# Altium project EMP_Drone_Flight_Controller.PrjPcb (part 1 of 2)
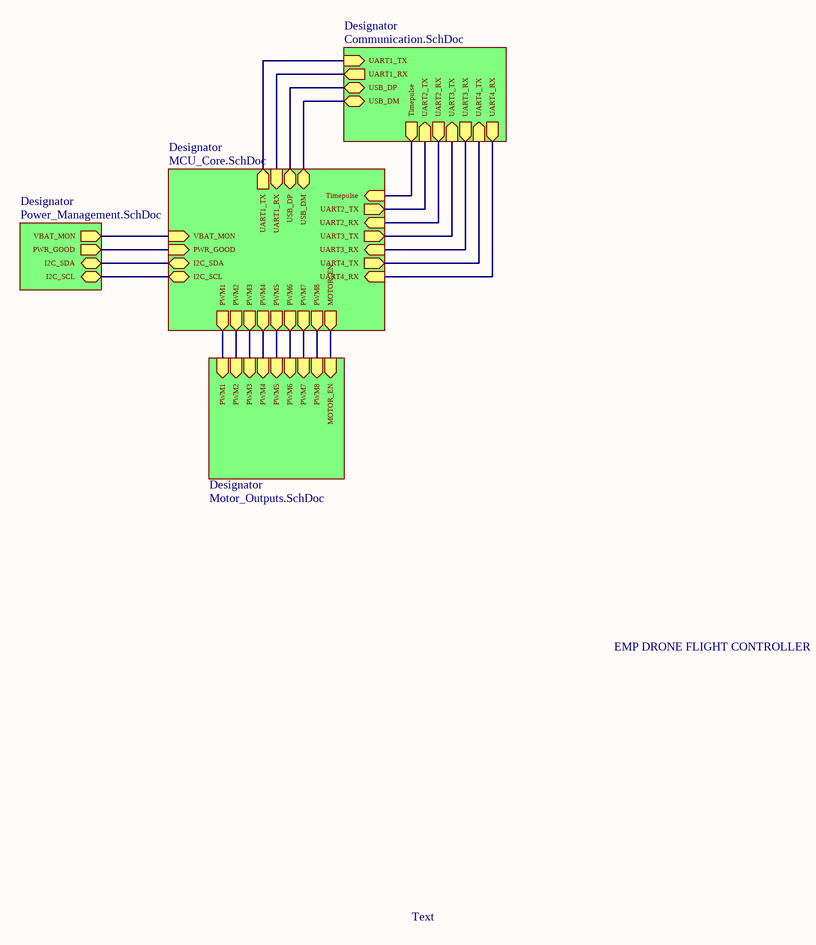
[diagram p0: EMP_FC_Main.SchDoc]
5 sheets, 137 parts. Net scope: hierarchical (ports join the sheet entries above them; power ports are global).
Board file: EMP_FC_PCB.PcbDoc
Sheets:
  EMP_FC_Main.SchDoc
    Designator = Power_Management.SchDoc
    Designator = MCU_Core.SchDoc
    Designator = Communication.SchDoc
    Designator = Motor_Outputs.SchDoc

## Sheet EMP_FC_Main.SchDoc
size A4; SheetNumber: 1; SheetTotal: 5

### Sub-sheets
Designator = Power_Management.SchDoc: VBAT_MON (out), PWR_GOOD (out), I2C_SDA (bidir), I2C_SCL (bidir)
Designator = MCU_Core.SchDoc: UART1_TX (out), UART1_RX (in), USB_DM (bidir), USB_DP (bidir), PWM5 (out), PWM4 (out), PWM3 (out), PWM2 (out), PWM1 (out), PWM6 (out), PWM7 (out), PWM8 (out), VBAT_MON (in), PWR_GOOD (in), MOTOR_EN (out), UART2_TX (out), UART3_TX (out), UART4_TX (out), UART2_RX (in), UART3_RX (in), UART4_RX (in), Timepulse (in), I2C_SDA (bidir), I2C_SCL (bidir)
Designator = Communication.SchDoc: UART1_TX (in), UART1_RX (out), USB_DP (bidir), USB_DM (bidir), UART2_RX (out), UART3_RX (out), UART4_RX (out), UART2_TX (in), UART3_TX (in), UART4_TX (in), Timepulse (out)
Designator = Motor_Outputs.SchDoc: PWM1 (in), PWM2 (in), PWM3 (in), PWM4 (in), PWM5 (in), MOTOR_EN (in), PWM6 (in), PWM7 (in), PWM8 (in)

### Nets
D_N: sheet Designator/USB_DM, sheet Designator/USB_DM
D_P: sheet Designator/USB_DP, sheet Designator/USB_DP
LMSCL: sheet Designator/I2C_SCL, sheet Designator/I2C_SCL
LMSDA: sheet Designator/I2C_SDA, sheet Designator/I2C_SDA
NetJ5_3: sheet Designator/MOTOR_EN, sheet Designator/MOTOR_EN
NetMD1_3: sheet Designator/Timepulse, sheet Designator/Timepulse
NetMD1_20: sheet Designator/UART4_RX, sheet Designator/UART4_RX
NetMD1_21: sheet Designator/UART4_TX, sheet Designator/UART4_TX
NetP1_2: sheet Designator/UART2_TX, sheet Designator/UART2_TX
NetP1_3: sheet Designator/UART2_RX, sheet Designator/UART2_RX
NetP2_2: sheet Designator/UART1_TX, sheet Designator/UART1_TX
NetP2_3: sheet Designator/UART1_RX, sheet Designator/UART1_RX
NetR9_1: sheet Designator/PWM1, sheet Designator/PWM1
NetR10_1: sheet Designator/PWM2, sheet Designator/PWM2
NetR11_1: sheet Designator/PWM3, sheet Designator/PWM3
NetR12_1: sheet Designator/PWM4, sheet Designator/PWM4
NetR13_1: sheet Designator/PWM5, sheet Designator/PWM5
NetR14_1: sheet Designator/PWM6, sheet Designator/PWM6
NetR15_1: sheet Designator/PWM7, sheet Designator/PWM7
NetR16_1: sheet Designator/PWM8, sheet Designator/PWM8
NetR42_1: sheet Designator/VBAT_MON, sheet Designator/VBAT_MON
NetU1_14: sheet Designator/UART3_TX, sheet Designator/UART3_TX
NetU1_15: sheet Designator/UART3_RX, sheet Designator/UART3_RX
NetU2_98: sheet Designator/PWR_GOOD, sheet Designator/PWR_GOOD

### Notes on the sheet
- EMP DRONE FLIGHT CONTROLLER
- Text

## Sheet Power_Management.SchDoc
size A3; SheetNumber: 2; SheetTotal: 5
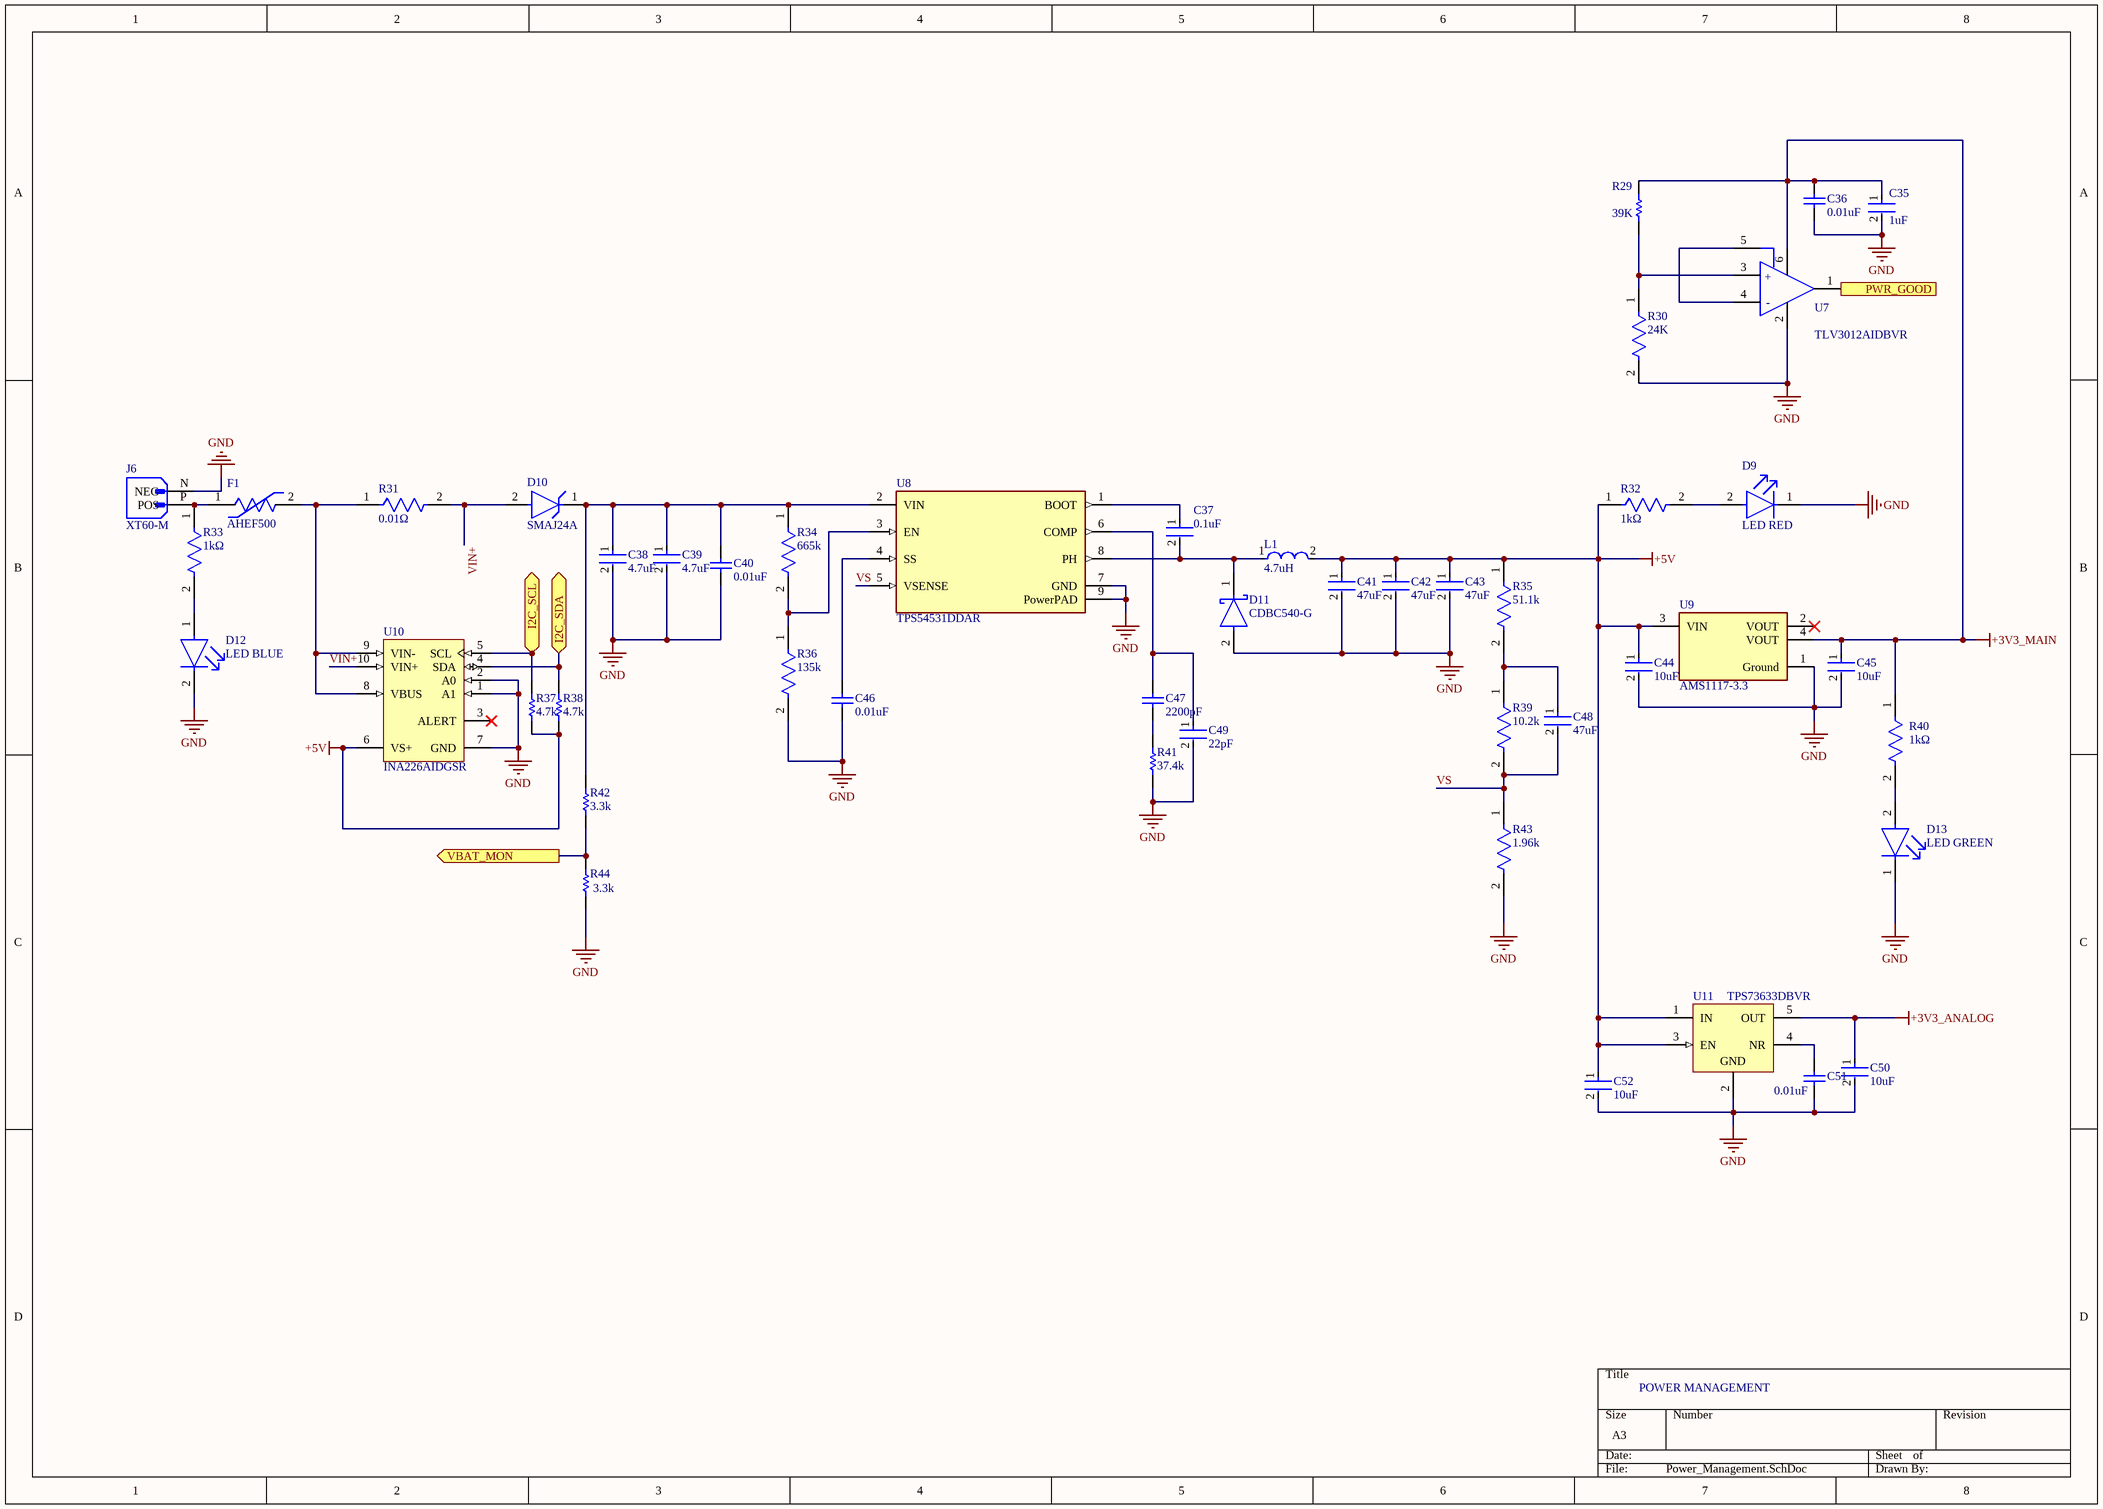
[diagram p1: Power_Management.SchDoc]

### Parts
C35  1uF  [FP-GCJ21B-0_3-IPC_B]
C36  0.01uF  [CAPC1608X87X35NL15T15]
C37  0.1uF  [FP-0805B-IPC_C]
C38  4.7uF  [FP-CC0603-DA-MFG]
C39  4.7uF  [FP-CC0603-DA-MFG]
C40  0.01uF  [CAPC1608X87X35NL15T15]
C41  47uF  [FP-0603-L_1_6_0_2-W_0_8_0-MFG]
C42  47uF  [FP-0603-L_1_6_0_2-W_0_8_0-MFG]
C43  47uF  [FP-0603-L_1_6_0_2-W_0_8_0-MFG]
C44  10uF  [FP-C0603C106M8PACTU-MFG]
C45  10uF  [FP-C0603C106M8PACTU-MFG]
C46  0.01uF  [CAPC1608X87X35NL15T15]
C47  2200pF  [CAPC1608X90X35NL15T15]
C48  47uF  [FP-0603-L_1_6_0_2-W_0_8_0-MFG]
C49  22pF  [FP-C0603C-CF-MFG]
C50  10uF  [FP-C0805C106K8RACAUTO-MFG]
C51  0.01uF  [CAPC1608X87X35NL15T15]
C52  10uF  [FP-C0805C106K8RACAUTO-MFG]
D9  LED RED  [FP-SML-LXT0805IW-TR-MFG]
D10  SMAJ24A  [FP-SMAJ-MFG]
D11  CDBC540-G  [FP-DO-214AB_SMC-MFG]
D12  LED BLUE  [FP-SM0805UBWC-MFG]
D13  LED GREEN  [FP-LTST-C171GKT-MFG]
F1  AHEF500  [FP-AHEF500-MFG]
J6  XT60-M  [AMASS_XT60-M]
L1  4.7uH  [FP-MLZ1608-IPC_A]
R29  39K  [RESC0603(1608)_L]
R30  24K  [FP-CRCW0603-Pe3-MFG]
R31  0.01Ω  [FP-GMR320-MFG]
R32  1kΩ  [FP-RNCF0603-MFG]
R33  1kΩ  [FP-RNCF0603-MFG]
R34  665k  [FP-CRCW0603-HPe3-IPC_B]
R35  51.1k  [FP-CRCW0603-e3-IPC_B]
R36  135k  [FP-CRCW0603-e3-IPC_C]
R37  4.7k  [RESC3225X75X50ML15T25]
R38  4.7k  [RESC3225X75X50ML15T25]
R39  10.2k  [FP-AC0603-IPC_B]
R40  1kΩ  [FP-RNCF0603-MFG]
R41  37.4k  [RESC1608X55X25NL10T15]
R42  3.3k  [RESC1812(4532)_L]
R43  1.96k  [FP-CRCW0603-HPe3-IPC_B]
R44  3.3k  [RESC2512(6432)_M]
U7  TLV3012AIDBVR  [FP-DBV0006A-IPC_B]
U8  TPS54531DDAR  [FP-DDA0008E-MFG]
U9  AMS1117-3.3  [FP-AMS1117-IPC_C]
U10  INA226AIDGSR  [DGS0010A_L]
U11  TPS73633DBVR  [DBV0005A_L]

### Ports
I2C_SCL (bidir, see EMP_FC_Main[2C], MCU_Core[7A]), I2C_SDA (bidir, see EMP_FC_Main[2C], MCU_Core[7A]), PWR_GOOD (out, see EMP_FC_Main[2C], MCU_Core[3B]), VBAT_MON (out, see EMP_FC_Main[2B], MCU_Core[3B])

### Nets
+3V3_ANALOG: C50.1 U11.5(OUT)
+3V3_MAIN: C35.1 C36.2 C45.1 R29.2 R40.1 U7.6(V+) U9.4(VOUT)
+5V: C41.1 C42.1 C43.1 C44.1 C52.1 L1.2 R32.1 R35.1 R37.1 R38.1 U9.3(VIN) U10.6(VS+) U11.1(IN) U11.3(EN)
GND: C35.2 C36.1 C38.2 C39.2 C40.1 C41.2 C42.2 C43.2 C44.2 C45.2 C46.1 C49.2 C50.2 C51.1 C52.2 D9.1(C) D11.2(A) D12.2(C) D13.1(C) J6.N(NEG) R30.2 R36.2 R41.1 R43.2 R44.1 U7.2(V-) U8.7(GND) U8.9(PowerPAD) U9.1(Ground) U10.1(A1) U10.2(A0) U10.7(GND) U11.2(GND)
LMSCL: R37.2 U10.5(SCL) ; port I2C_SCL
LMSDA: R38.2 U10.4(SDA) ; port I2C_SDA
VIN+: D10.2(A) R31.2 U10.10(VIN+)
VS: C48.2 R39.2 R43.1 U8.5(VSENSE)
NetC37_1: C37.1 U8.1(BOOT)
NetC37_2: C37.2 D11.1(C) L1.1 U8.8(PH)
NetC38_1: C38.1 C39.1 C40.2 D10.1(C) R34.1 R42.2 U8.2(VIN)
NetC46_2: C46.2 U8.4(SS)
NetC47_1: C47.1 R41.2
NetC47_2: C47.2 C49.1 U8.6(COMP)
NetC48_1: C48.1 R35.2 R39.1
NetC51_2: C51.2 U11.4(NR)
NetD9_2: D9.2(A) R32.2
NetD12_1: D12.1(A) R33.2
NetD13_2: D13.2(A) R40.2
NetF1_1: F1.1 J6.P(POS) R33.1
NetF1_2: F1.2 R31.1 U10.8(VBUS) U10.9(VIN-)
NetR29_1: R29.1 R30.1 U7.3(IN+)
NetR34_2: R34.2 R36.1 U8.3(EN)
NetR42_1: R42.1 R44.2 ; port VBAT_MON
NetU2_98: U7.1(OUT) ; port PWR_GOOD
NetU7_4: U7.4(IN-) U7.5(REF)

Not connected (* = marked no-connect by the designer): U9 2(VOUT)*; U10 3(ALERT)*

### Notes on the sheet
- POWER MANAGEMENT
- (in symbol CMP-04896-000075-1) +

### Library data of the parts
C35 = CMP-06035-032003-1: Multilayer Ceramic Capacitors MLCC - SMD/SMT 0805 1uF 10%, 16VDC,  X8L +15/-40%
C36 C40 C46 C51 = CMP-2006-03841-1: Part Number: C0603S103J5RACTU; Manufacturer: Kemet
C37 = CMP-45632-000003-1: CAP CER 0.1UF 50V X7R 0805; Capacitance: 100nF; Tolerance: 10%; RoHS Compliant: Yes; Packaging: Tape and Reel; Voltage Rating (DC): 50V; Voltage Rating: 50V; Length: 2mm; Lead Free: Lead Free; Voltage: 50V; Case/Package: 0805; Case Code (Metric): 2012; Depth: 1.25mm; Min Operating Temperature: -55°C; Case Code (Imperial): 0805; Max Operating Temperature: 125°C; Radiation Hardening: No; Dielectric: X7R
C38 C39 = CMP-03422-001217-1: CAP CER 4.7UF 25V X5R 0603; Manufacturer: YAGEO; Manufacturer Part Number: CC0603KRX5R8BB475; Material: Ceramic; Temperature Coefficient: 15%; Tolerance: 0.1; Device Class L1: Passive Components; Temperature: -55°C to +125°C; Value: 4.7 uF; RoHS: TRUE; Temperature Range High: +125°C; Automotive: No; Lead Free: Yes; Digikey Description: CAP CER 4.7UF 25V X5R 0603; Category: Cap; Temperature Characteristic: X5R; Package: CC0603-DA; Device Class L2: Capacitors; Temperature Range Low: -55°C; Voltage Rating: 25 V; Capacitance: 4.7 uF; ComponentLink2URL: http://www.yageo.com/documents/recent/UPY-GPHC_X7R_6.3V-to-50V_18.pdf; Octopart: https://octopart.com/cc0603krx5r8bb475-yageo-77825350; Footprint Url: http://www.yageo.com/exep/pages/download/literatures/UPY-C_GEN_24.pdf; Device Class L3: Ceramic Capacitors; ComponentLink2Description: Datasheet; Voltage: 25 V; Height: 0.9mm
C41-C43 C48 = CMP-14477-005318-1: Multilayer Ceramic Capacitor 47uF 4V X6S 20% SMD 0603 T/R
C44 C45 = CMP-03020-034654-1: CAP CER 10UF 10V X5R 0603; RoHS Compliant: Yes
C47 = CMP-2006-04411-1: Manufacturer: AVX Interconnect / Elco; Part Number: 06035C222KAZ2A
C49 = CMP-03020-026027-1: CAP CER 22PF 100V C0G/NP0 0603; Manufacturer: KEMET; Manufacturer Part Number: C0603C220J1GACAUTO; Material: Ceramic; Temperature Coefficient: 30ppm/°C; Temperature Characteristic: C0G; Automotive Grade: Grade 1; Tolerance: 0.05; Value: 22 pF; Device Class L2: Capacitors; Digikey Description: CAP CER 22PF 100V C0G/NP0 0603; Device Class L3: Ceramic Capacitors; Package: C0603C-CF; Temperature Range Low: -55°C; Automotive: Yes; Voltage Rating: 100 V; Category: Cap; Temperature Range High: +125°C; Lead Free: Yes; RoHS: TRUE; Temperature: -55°C to +125°C; ComponentLink2Description: Datasheet; ComponentLink2URL: https://api.kemet.com/component-edge/download/datasheet/C0603C100J5GACAUTO.pdf; Mouser Description: Cap Ceramic 22pF 100V C0G 5% SMD 0603 125°C Paper T/R; Octopart: https://octopart.com/c0603c220j1gacauto-kemet-75613140; Capacitance: 22 pF; Device Class L1: Passive Components; Height: 0.87mm
C50 C52 = CMP-03020-034662-1: CAP CER 10UF 10V X7R 0805; Tolerance: 10%; Case/Package: 0805; Ratings: AEC-Q200; Packaging: Tape and Reel; Voltage Rating: 10V; Max Operating Temperature: 125°C; Min Operating Temperature: -55°C; Case Code (Metric): 2012; Case Code (Imperial): 0805; Mount: Surface Mount; RoHS Compliant: Yes; Capacitance: 10uF
D9 = CMP-1724-00002-2: LED RED DIFFUSED SMD; Lens Style: Rectangular; Luminous Intensity: 11mcd; Approvals: UL; Test Current: 20mA; Forward Voltage: 2V; Number of LEDs: 1; Wavelength: 635nm; Lens Color: White; Viewing Angle: 140°; Min Operating Temperature: -25°C; Case Code (Metric): 2012; Mount: Surface Mount; Case Code (Imperial): 0805; Height: 0.8mm; Lead Free: Lead Free; Color: Red; Package Quantity: 1; Illumination Color: Red; Lens Transparency: Diffused; Forward Current: 20mA; Packaging: Tape and Reel; Length: 2mm; Case/Package: 0805; REACH SVHC: No SVHC; Width: 1.25mm; Number of Pins: 2; Max Operating Temperature: 80°C; Dominant Wavelength: 635nm
D10 = CMP-08607-000085-1: TVS DIODE 24V 38.9V DO214AC; Manufacturer: Littelfuse Inc; Direction: Unidirectional; Peak Pulse Power: 400W; Peak Pulse Current: 10.3A; Max Junction Temp: +150°C; Breakdown Voltage: 26.7V; Number Of Channels: 1; ComponentLink2Description: Datasheet; Device Class L3: unset; Height: 2.29mm; ComponentLink2URL: https://www.littelfuse.com/~/media/electronics/datasheets/tvs_diodes/littelfuse_tvs_diode_smaj_datasheet.pdf.pdf; Device Class L1: Circuit Protection; Package: SMAJ; Temperature Range High: +150°C; Device Class L2: TVS Diodes; Clamping Voltage: 38.9V; Reverse Standoff Voltage: 24V; Manufacturer Part Number: SMAJ24A; Mouser Description: In a Pack of 25, Littelfuse SMAJ24A, Uni-Directional TVS Diode, 400W, 2-Pin DO-214AC; Digikey Description: TVS DIODE 24V 38.9V DO214AC; Lead Free: Yes; Octopart: https://octopart.com/smaj24a-littelfuse-350003; Automotive: No; Temperature Range Low: -65°C; Category: Diode; RoHS: TRUE; Temperature: -65°C to +150°C
D11 = CMP-20227-000004-1: DIODE SCHOTTKY 40V 5A DO214AB; Max Surge Current: 100A; Max Reverse Leakage Current: 500uA; Number of Pins: 2; Packaging: Tape and Reel; Max Reverse Voltage (DC): 40V; Package Quantity: 1; Average Rectified Current: 5A; Mount: Surface Mount
D12 = CMP-35283-000004-1: LED BLUE CLEAR 0805 SMD; Dominant Wavelength: 470nm; Forward Voltage: 3.3V; Forward Current: 20mA; Lens Color: Colorless; Lens Style: Rectangular; Luminous Intensity: 115mcd; Viewing Angle: 130°; Power Rating: 100mW; Lens Transparency: Clear; Height: 1.1mm; Mount: Surface Mount; Packaging: Tape and Reel; Package Quantity: 3000; Illumination Color: Blue; Width: 1.2mm; Min Operating Temperature: -30°C; Case Code (Imperial): 0805; Length: 2mm; Test Current: 20mA; Max Operating Temperature: 80°C; Case Code (Metric): 2012; Color: Blue; Wavelength: 470nm; Case/Package: 0805; Lead Free: Lead Free; Number of Pins: 2
D13 = CMP-22017-000007-1: LED GREEN CLEAR CHIP SMD; Luminous Intensity: 12mcd; Lens Color: Colorless; Dominant Wavelength: 569nm; Number of LEDs: 1; Power Dissipation: 100mW; Viewing Angle: 130°; Reverse Voltage: 5V; Test Current: 10mA; Forward Voltage: 2.1V; Wavelength: 585nm; Lens Style: Diffused; Forward Current: 30mA; Height: 0.8mm; Mount: Surface Mount; Package Quantity: 1; Length: 2mm; Case Code (Metric): 2012; Number of Pins: 2; Number of Elements: 1; Packaging: Tape and Reel; Color: Green; Min Operating Temperature: -55°C; Case/Package: 0805; Power Rating: 100mW; Max Operating Temperature: 85°C; Radiation Hardening: No; Depth: 1.25mm; Lens Transparency: Clear; Width: 1.25mm; Lead Free: Lead Free; Case Code (Imperial): 0805; Illumination Color: Green
F1 = CMP-08606-000056-1: PTC RESET FUSE 32V 5A RADIAL; Manufacturer: Littelfuse Inc.; Trip Current: 10A; Current Rating: 100A; Trip Time: 9s; Value: 0.015-0.04Ω; Automotive Grade: Grade 1; Temperature: -40°C to +125°C; Device Class L1: Circuit Protection; Height: 24.1mm; ComponentLink2Description: Datasheet; RoHS: TRUE; Temperature Range High: +125°C; Device Class L3: unset; ComponentLink2URL: https://www.littelfuse.com/~/media/electronics/datasheets/resettable_ptcs/littelfuse_ptc_radial_leaded_ahef_datasheet.pdf.pdf; Octopart: https://octopart.com/ahef500-littelfuse-74214520; Mouser Description: PTC Resettable Fuse 5A(hold) 10A(trip) 32VDC 100A 5.3W 9s 0.015Ohm Radial 14 X 3.8 X 24.1mm Bulk Automotive; Voltage Rating: 32V; Package: 0; Ambient Temperature Range Low: -40°C; Manufacturer Part Number: AHEF500; Device Class L2: PTC Resettable Fuses; Category: Fuse; Hold Current: 5A; Automotive: Yes; Ambient Temperature Range High: +125°C; Lead Free: Yes; Digikey Description: PTC RESET FUSE 32V 5A RADIAL; Temperature Range Low: -40°C; Resistance: 0.015-0.04Ω
J6 = XT60-M: Plug; DC supply; XT60; male; PIN: 2; for cable; soldered; 30A; 500V; MF: AMASS; SnapEDA_Link: https://www.snapeda.com/parts/XT60-M/AMASS/view-part/?ref=snap; Package: Package; Value: *; MP: XT60-M; Check_prices: https://www.snapeda.com/parts/XT60-M/AMASS/view-part/?ref=eda
L1 = CMP-08253-000311-1: Shielded Multilayer Inductor 4.7uH ±20% 350mA 650mΩ SMD 0603; DC Resistance (DCR): 650mR; Test Frequency: 2MHz; Self Resonant Frequency: 80MHz; Core Material: Ferrite; Saturation Current: 120mA; Packaging: Tape and Reel; Width: 0.031inch; Height - Seated (Max): 0.037inch; Inductance: 4.7uH; Current Rating: 350mA; Max Operating Temperature: 125°C; Tolerance: 20%; Length: 0.063inch; Package Quantity: 4000; Case/Package: 0603; Case Code (Imperial): 0603; Min Operating Temperature: -55°C; Case Code (Metric): 1608; RoHS Compliant: Yes; Shielding: Shielded; Mount: Surface Mount
R29 = CMP-1012-00112-1: 39K 0.1W 5% 0603 (1608 Metric)  SMD; Case-Metric: 1608; Case-EIA: 0603; Value: 39000.00 Ohm; Technology: SMT; Tolerance: 5 %; Power: 0.1 W
R30 = CMP-03613-000177-1: RES Thick Film, 24kΩ, 0.5%, 0.1W, 50ppm/°C, 0603; Max Power Dissipation: 100mW; Resistance: 24kR; Tolerance: 0.5%; Temperature Coefficient: 50ppm/°C; Package Quantity: 5000; Width: 0.033inch; Length: 0.061inch; Features: Automotive AEC-Q200; Packaging: Tape and Reel; RoHS Compliant: Yes; Series: CRCW-P; Case/Package: 0603; Height: 0.02inch; Max Operating Temperature: 155°C; Resistor Type: Thick Film; Number of Terminations: 2; Min Operating Temperature: -55°C
R31 = CMP-08839-027812-1: RES 10M OHM 1% 10W 2817
R32 R33 R40 = CMP-26527-000463-1: RES 1K OHM, 0.01%, 2 PPM, 0.1W,; RoHS Compliant: Yes
R34 = CMP-02407-005241-1: RES Thick Film, 665kΩ, 1%, 0.33W, 100ppm/°C, 0603; Max Power Dissipation: 250mW; Resistance: 665kR; Max Operating Temperature: 155°C; Tolerance: 1%; Features: Automotive AEC-Q200; Height: 0.022inch; Width: 0.033inch; Package Quantity: 5000; Lead Free: Lead Free; Min Operating Temperature: -55°C; Temperature Coefficient: 100ppm/°C; Packaging: Tape and Reel; Length: 0.063inch; Composition: Thick Film; Case/Package: 0603; Number of Terminations: 2
R35 = CMP-02407-006544-1: RES Thick Film, 511kΩ, 1%, 0.1W, 100ppm/°C, 0603; Resistance: 511kR; Max Power Dissipation: 100mW; Min Operating Temperature: -55°C; Lead Free: Lead Free; Width: 0.033inch; Max Operating Temperature: 155°C; Temperature Coefficient: 100ppm/°C; Packaging: Tape and Reel; Tolerance: 1%; Composition: Thick Film; Features: Automotive AEC-Q200; Case/Package: 0603; Package Quantity: 20000; Length: 0.061inch; Number of Terminations: 2; Height: 0.02inch
R36 = CMP-02407-003653-1: RES Thick Film, 130kΩ, 5%, 0.1W, 200ppm/°C, 0603; Resistance: 130kR; Max Power Dissipation: 100mW; Features: Automotive AEC-Q200; Packaging: Tape and Reel; Temperature Coefficient: 200ppm/°C; Number of Terminations: 2; Width: 0.033inch; Composition: Thick Film; Min Operating Temperature: -55°C; Length: 0.061inch; Max Operating Temperature: 155°C; Height: 0.02inch; Lead Free: Lead Free; Case/Package: 0603; Tolerance: 5%; Package Quantity: 20000
R37 R38 = CMP-2005-00861-1: Manufacturer: Vishay Dale; Part Number: TNPW12104K70BETA
R39 = CMP-03412-037842-1: RES 2kΩ 1.00% 0.1W 0603; Resistance: 2kR; Tolerance: 1%; RoHS Compliant: Yes; Case/Package: 0603
R41 = CMP-2000-04027-1: Part Number: RC0603FR-07374KL; Manufacturer: Yageo
R42 = CMP-1016-00602-1: 10K 0.75W 1% 1812 (4532 Metric)  SMD; Case-EIA: 1812; Case-Metric: 4532; Value: 10000.00 Ohm; Technology: SMT; Power: 0.75 W; Tolerance: 1 %
R43 = CMP-02407-003606-1: RES Thick Film, 1.96kΩ, 1%, 0.33W, 100ppm/°C, 0603; Resistance: 1.96kR; Max Power Dissipation: 250mW; Features: Automotive AEC-Q200; Packaging: Tape and Reel; Length: 0.063inch; Max Operating Temperature: 155°C; Tolerance: 1%; Temperature Coefficient: 100ppm/°C; Min Operating Temperature: -55°C; Case/Package: 0603; Composition: Thick Film; Number of Terminations: 2; Width: 0.033inch; Package Quantity: 5000; Lead Free: Lead Free; Height: 0.022inch
R44 = CMP-1018-00567-1: 3K3 1W 1% 2512 (6432 Metric)  SMD; Value: 3300.00 Ohm; Case-Metric: 6432; Case-EIA: 2512; Tolerance: 1 %; Power: 1 W; Technology: SMT
U7 = CMP-04896-000075-1: IC COMPARATOR 1.8V W/REF SOT23-6; Max Supply Current: 5uA; Max Input Current: 10pA; Number of Elements: 1; Response Time: 6us; Propagation Delay: 13.5us; Max Supply Voltage: 5.5V; Input Offset Voltage (Vos): 12mV; Output Current: 500uA; Power Supply Rejection Ratio (PSRR): 80dB; Common Mode Rejection Ratio: 74dB; Output Type: PUSH-PULL; Max Operating Temperature: 85°C; REACH SVHC: No SVHC; Mount: Surface Mount; Case/Package: SOT-23-6; Min Operating Temperature: -40°C; Min Supply Voltage: 1.8V; Number of Channels: 1; Series: -; Packaging: Tape and Reel; Input Bias Current: 10pA; Lead Free: Lead Free; Number of Pins: 6; Package Quantity: 3000; Nominal Supply Current: 5uA; Radiation Hardening: No; RoHS Compliant: Yes; Contact Plating: Gold; Supply Current: 5uA; Quiescent Current: 5uA
U8 = CMP-04918-000157-1: IC REG BUCK ADJUSTABLE 5A 8SOPWR; Switching Frequency: 570kHz; Output Configuration: Positive; Min Supply Voltage: 3.5V; Output Voltage: 25V; Max Input Voltage: 28V; Number of Outputs: 1; Min Output Voltage: 800mV; Max Output Voltage: 26.04V; Synchronous Rectifier: No; Quiescent Current: 110uA; Case/Package: SOIC; Number of Pins: 8; Package Quantity: 2500; Mount: Surface Mount; REACH SVHC: No SVHC; Min Operating Temperature: -40°C; Max Operating Temperature: 85°C; Max Output Current: 5A; Packaging: Tape and Reel; Lead Free: Lead Free; Output Type: Adjustable; Radiation Hardening: No; Output Current: 5A; Min Input Voltage: 3.5V; Operating Supply Voltage: 28V
U9 = CMP-209535-000001-1: LDO Voltage Regulators 1A, 3.3V; Manufacturer: Advanced Monolithic Systems; Dropout Voltage: 1.1V; Output Type: Fixed; Nominal Supply Current: 5mA; Max Power Dissipation: 1.2W; Max Supply Voltage: 15V; Number Of Outputs: 1; Standoff Height: 0.64mm; Max Junction Temp: +125°C; Height: 1.8mm; Package: AMS1117; Device Class L2: Power Management ICs; ComponentLink2Description: Datasheet; ComponentLink2URL: http://www.advanced-monolithic.com/pdf/ds1117.pdf; Category: IC; RoHS: TRUE; Automotive: No; Device Class L1: Integrated Circuits (ICs); Output Current: 1A; Device Class L3: Voltage Regulators - Linear; Temperature: -40°C to +125°C; Output Voltage: 3.3V; Manufacturer Part Number: AMS1117-3.3; Temperature Range Low: -40°C; Octopart: https://octopart.com/ams1117-3.3-advanced+monolithic+systems-25899300; Lead Free: Yes; Ipc Land Pattern Name: SOT229P700X180-4; Temperature Range High: +125°C
U10 = CMP-0704-00058-2: High-Side Measurement, Bi-Directional Current / Power Monitor with I2C Interface, 2.7 to 5.5 V, -40 to 125 degC, 10-pin SOP (DGS10), Green (RoHS & no Sb/Br); Vs(Max)(V): 5.5; CMRR(Min)(dB): 126; Rating: Catalog; Input Offset (+/-)(Max)(uV): 10; Small-Signal Bandwidth(Typ)(MHz): 0.007; Input Offset Drift (+/-)(Max)(uV/Degrees Celsius): 0.1; Common Mode Range(Max)(V): 36; Gain(V/V): 1; SubFamily: Current Shunt Monitor; Quiescent Current (+/-)(Typ)(mA): 0.33; Vs(Min)(V): 2.7; Common Mode Range(Min)(V): 0; ComponentLink2URL: http://www.ti.com/general/docs/lit/getliterature.tsp?genericPartNumber=INA226&fileType=pdf; ComponentLink1URL: http://www.ti.com/; PartNumber: INA226AIDGSR; Mounting Technology: Surface Mount; PackageDescription: 10-Pin Plastic Small Outline, Body 3 x 3 mm, Pitch 0.5 mm; ComponentLink3Description: Package Specification; Code_JEDEC: MO-153; Eco-Plan: Green (RoHS & no Sb/Br); PackageReference: DGS0010A; ComponentLink2Description: Datasheet; ComponentLink3URL: http://www.ti.com/lit/ml/mpds035b/mpds035b.pdf; ComponentLink1Description: Manufacturer URL; DatasheetVersion: SBOS547; PackageVersion: 4073272/C, 02/2004
U11 = CMP-0395-00256-2: Single Output Low Noise LDO, 400 mA, Fixed 3.3 V Output, 1.7 to 5.5 V Input, with Reverse Current Protection, 5-pin SOT-23 (DBV), -40 to 85 degC, Green (RoHS & no Sb/Br); Manufacturer: Texas Instruments; Vin(Min)(V): 1.7; Vdo(Typ)(mV): 75; Iq(Typ)(mA): 0.3; SubFamily: Single Channel LDO; Vout Adj(Max)(V): 3.3; Accuracy(%): 1; Vin(Max)(V): 5.5; Iout(Max)(A): 0.4; Rating: Catalog; ComponentLink1Description: Manufacturer URL; PartNumber: TPS73633DBVR; PackageDescription: 5-Pin Plastic Small Outline, Body 1.60 Ãƒâ€” 2.90 mm, Pitch 0.95 mm; ComponentLink3URL: http://www.ti.com/litv/pdf/mpds018i; ComponentLink2Description: Datasheet; ComponentLink4Description: URL Link1; DatasheetVersion: SBVS038T; Vout Adj(Min)(V): 3.3; Code_JEDEC: MO-178; Fixed Output Options(V): 3.3; Eco-Plan: Green (RoHS & no Sb/Br); PackageReference: DBV0005A; ComponentLink4URL: Samples URL:http://www.ti.com/product/tps73633#samples; PackageVersion: 4073253-4/K; ComponentLink2URL: http://www.ti.com/general/docs/lit/getliterature.tsp?genericPartNumber=TPS73633&fileType=pdf; ComponentLink1URL: http://www.ti.com/; ComponentLink3Description: Package Specification; Mounting Technology: Surface Mount

## Sheet MCU_Core.SchDoc
size A3; SheetNumber: 3; SheetTotal: 5
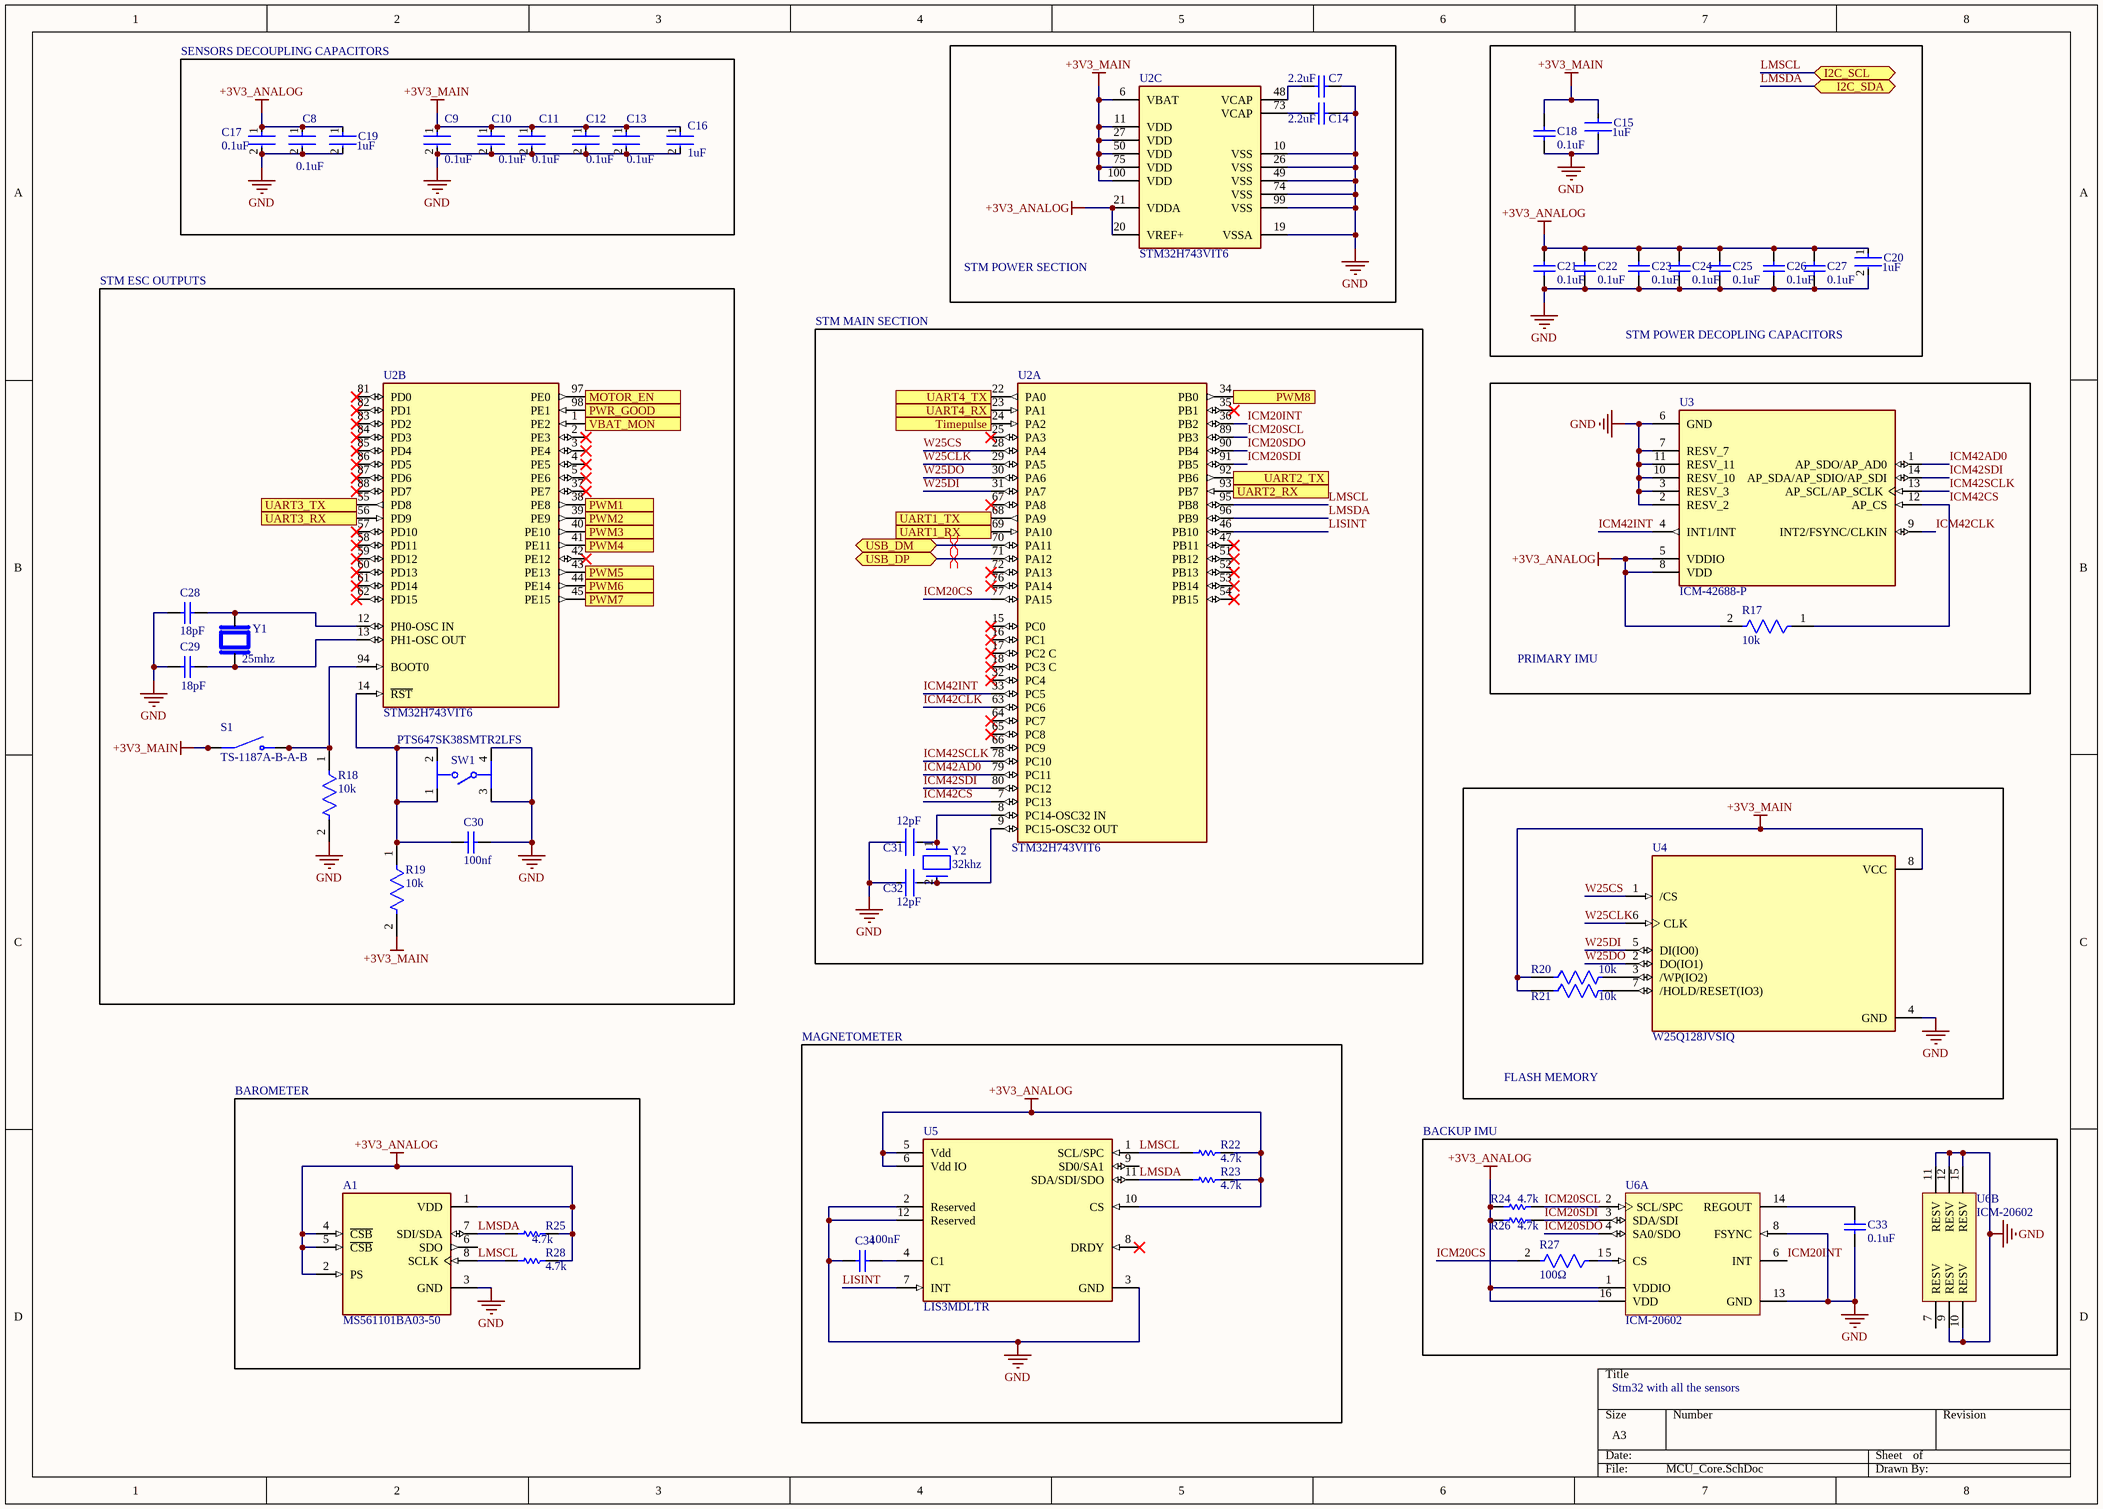
[diagram p2: MCU_Core.SchDoc]

### Parts
A1  MS561101BA03-50  [XDCR_MS561101BA03-50]
C7  2.2uF  [CAPC1608X90X35ML15T15]
C8  0.1uF  [FP-0201-L_0_6_0_05-W_0_3-MFG]
C9  0.1uF  [FP-0201-L_0_6_0_05-W_0_3-MFG]
C10  0.1uF  [FP-0201-L_0_6_0_05-W_0_3-MFG]
C11  0.1uF  [FP-0201-L_0_6_0_05-W_0_3-MFG]
C12  0.1uF  [FP-0201-L_0_6_0_05-W_0_3-MFG]
C13  0.1uF  [FP-0201-L_0_6_0_05-W_0_3-MFG]
C14  2.2uF  [CAPC1608X90X35ML15T15]
C15  1uF  [FP-GCJ21B-0_3-IPC_B]
C16  1uF  [FP-GCJ21B-0_3-IPC_B]
C17  0.1uF  [FP-0201-L_0_6_0_05-W_0_3-MFG]
C18  0.1uF  [CAPC1608X87X35ML15T15]
C19  1uF  [FP-GCJ21B-0_3-IPC_B]
C20  1uF  [FP-GCJ21B-0_3-IPC_B]
C21  0.1uF  [CAPC1608X87X35ML15T15]
C22  0.1uF  [CAPC1608X87X35ML15T15]
C23  0.1uF  [CAPC1608X87X35ML15T15]
C24  0.1uF  [CAPC1608X87X35ML15T15]
C25  0.1uF  [CAPC1608X87X35ML15T15]
C26  0.1uF  [CAPC1608X87X35ML15T15]
C27  0.1uF  [CAPC1608X87X35ML15T15]
C28  18pF  [CAPC1608X92X38NL15T08]
C29  18pF  [CAPC1608X92X38NL15T08]
C30  100nf  [CAPC1608X90X35LL15T15]
C31  12pF  [FP-C0603C-CF-MFG]
C32  12pF  [FP-C0603C-CF-MFG]
C33  0.1uF  [CAPC1608X87X35ML15T15]
C34  100nF  [CAPC1608X87X35ML15T15]
R17  10k  [FP-AC0603-IPC_A]
R18  10k  [FP-MCT0603-IPC_B]
R19  10k  [FP-MCT0603-IPC_B]
R20  10k  [FP-CRGP0805-IPC_C]
R21  10k  [FP-CRGP0805-IPC_C]
R22  4.7k  [RESC3225X75X50ML15T25]
R23  4.7k  [RESC3225X75X50ML15T25]
R24  4.7k  [RESC3225X75X50ML15T25]
R25  4.7k  [RESC3225X75X50ML15T25]
R26  4.7k  [RESC3225X75X50ML15T25]
R27  100Ω  [FP-RMCF0805-IPC_A]
R28  4.7k  [RESC3225X75X50ML15T25]
S1  TS-1187A-B-A-B  [SW_TS-1187A-B-A-B]
SW1  PTS647SK38SMTR2LFS  [FP-PTS647SK38SMTR2LFS-MFG]
U2  STM32H743VIT6  [FP-LQFP100-1L-MFG]  (parts A,B,C of 3)
U3  ICM-42688-P  [PQFN50P300X250X97-14N]
U4  W25Q128JVSIQ  [SOIC127P790X216-8N]
U5  LIS3MDLTR  [FP-VFLGA-12-8365767-MFG]
U6  ICM-20602  [INSE-I62-16]  (parts A,B of 2)
Y1  25mhz  [XTAL_SXT32412BB07-25.000MT]
Y2  32khz  [FP-ABS07-MFG]

### Blocks framed on the sheet
SENSORS DECOUPLING CAPACITORS: C8-C13 C16 C17 C19
STM POWER SECTION: C7 C14 U2
STM POWER DECOPLING CAPACITORS: C15 C18 C20-C27
STM ESC OUTPUTS: C28-C30 R18 R19 S1 SW1 U2 Y1
STM MAIN SECTION: C31 C32 U2 Y2
PRIMARY IMU: R17 U3
FLASH MEMORY: R20 R21 U4
BAROMETER: A1 R25 R28
MAGNETOMETER: C34 R22 R23 U5
BACKUP IMU: C33 R24 R26 R27 U6

### Ports
I2C_SCL (bidir, see EMP_FC_Main[2C], Power_Management[3B]), I2C_SDA (bidir, see EMP_FC_Main[2C], Power_Management[3B]), MOTOR_EN (out, see EMP_FC_Main[3C], Motor_Outputs[2C]), PWM1 (out, see EMP_FC_Main[2C], Motor_Outputs[2B]), PWM2 (out, see EMP_FC_Main[2C], Motor_Outputs[2B]), PWM3 (out, see EMP_FC_Main[2C], Motor_Outputs[2B]), PWM4 (out, see EMP_FC_Main[2C], Motor_Outputs[2B]), PWM5 (out, see EMP_FC_Main[2C], Motor_Outputs[2B]), PWM6 (out, see EMP_FC_Main[2C], Motor_Outputs[2B]), PWM7 (out, see EMP_FC_Main[2C], Motor_Outputs[2B]), PWM8 (out, see EMP_FC_Main[3C], Motor_Outputs[2C]), PWR_GOOD (in, see EMP_FC_Main[2C], Power_Management[8A]), Timepulse (in, see EMP_FC_Main[3B], Communication[3C]), UART1_RX (in, see EMP_FC_Main[2B], Communication[1D]), UART1_TX (out, see EMP_FC_Main[2B], Communication[1D]), UART2_RX (in, see EMP_FC_Main[3B], Communication[1C]), UART2_TX (out, see EMP_FC_Main[3B], Communication[1C]), UART3_RX (in, see EMP_FC_Main[3C], Communication[1B]), UART3_TX (out, see EMP_FC_Main[3B], Communication[1B]), UART4_RX (in, see EMP_FC_Main[3C], Communication[3B]), UART4_TX (out, see EMP_FC_Main[3C], Communication[3B]), USB_DM (bidir, see EMP_FC_Main[2B], Communication[2D]), USB_DP (bidir, see EMP_FC_Main[2B], Communication[2D]), VBAT_MON (in, see EMP_FC_Main[2B], Power_Management[2C])

### Nets
+3V3_ANALOG: A1.1(VDD) A1.2(PS) A1.4(~{CSB}) A1.5(~{CSB}) C8.1 C17.1 C19.1 C20.1 C21.2 C22.2 C23.2 C24.2 C25.2 C26.2 C27.2 R17.2 R22.2 R23.2 R24.2 R25.2 R26.2 R28.2 U2.20(VREF+) U2.21(VDDA) U3.5(VDDIO) U3.8(VDD) U5.5(Vdd) U5.6(Vdd_IO) U5.10(CS) U6.1(VDDIO) U6.16(VDD)
+3V3_MAIN: C9.1 C10.1 C11.1 C12.1 C13.1 C15.1 C16.1 C18.2 R19.2 R20.1 R21.1 S1.A(COM) S1.B(COM) U2.6(VBAT) U2.11(VDD) U2.27(VDD) U2.50(VDD) U2.75(VDD) U2.100(VDD) U4.8(VCC)
GND: A1.3(GND) C7.2 C8.2 C9.2 C10.2 C11.2 C12.2 C13.2 C14.2 C15.2 C16.2 C17.2 C18.1 C19.2 C20.2 C21.1 C22.1 C23.1 C24.1 C25.1 C26.1 C27.1 C28.1 C29.1 C30.1 C31.1 C32.1 C33.1 C34.1 R18.2 SW1.3 SW1.4 U2.10(VSS) U2.19(VSSA) U2.26(VSS) U2.49(VSS) U2.74(VSS) U2.99(VSS) U3.2(RESV_2) U3.3(RESV_3) U3.6(GND) U3.7(RESV_7) U3.10(RESV_10) U3.11(RESV_11) U4.4(GND) U5.2(Reserved) U5.3(GND) U5.12(Reserved) U6.8(FSYNC) U6.9(RESV) U6.10(RESV) U6.11(RESV) U6.12(RESV) U6.13(GND) U6.15(RESV)
D_N: U2.70(PA11) ; port USB_DM
D_P: U2.71(PA12) ; port USB_DP
ICM20CS: R27.2 U2.77(PA15)
ICM20INT: U2.36(PB2) U6.6(INT)
ICM20SCL: R24.1 U2.89(PB3) U6.2(SCL/SPC)
ICM20SDI: R26.1 U2.91(PB5) U6.3(SDA/SDI)
ICM20SDO: U2.90(PB4) U6.4(SA0/SDO)
ICM42AD0: U2.79(PC11) U3.1(AP_SDO/AP_AD0)
ICM42CLK: U2.63(PC6) U3.9(INT2/FSYNC/CLKIN)
ICM42CS: R17.1 U2.7(PC13) U3.12(AP_CS)
ICM42INT: U2.33(PC5) U3.4(INT1/INT)
ICM42SCLK: U2.78(PC10) U3.13(AP_SCL/AP_SCLK)
ICM42SDI: U2.80(PC12) U3.14(AP_SDA/AP_SDIO/AP_SDI)
LISINT: U2.46(PB10) U5.7(INT)
LMSCL: A1.8(SCLK) R22.1 R28.1 U2.95(PB8) U5.1(SCL/SPC) ; port I2C_SCL
LMSDA: A1.7(SDI/SDA) R23.1 R25.1 U2.96(PB9) U5.11(SDA/SDI/SDO) ; port I2C_SDA
W25CLK: U2.29(PA5) U4.6(CLK)
W25CS: U2.28(PA4) U4.1(/CS)
W25DI: U2.31(PA7) U4.5(DI(IO0))
W25DO: U2.30(PA6) U4.2(DO(IO1))
NetC7_1: C7.1 U2.48(VCAP)
NetC14_1: C14.1 U2.73(VCAP)
NetC28_2: C28.2 U2.12(PH0-OSC_IN) Y1.3
NetC29_2: C29.2 U2.13(PH1-OSC_OUT) Y1.1
NetC30_2: C30.2 R19.1 SW1.1 SW1.2 U2.14(~{RST})
NetC31_2: C31.2 U2.8(PC14-OSC32_IN) Y2.1
NetC32_2: C32.2 U2.9(PC15-OSC32_OUT) Y2.2
NetC33_2: C33.2 U6.14(REGOUT)
NetC34_2: C34.2 U5.4(C1)
NetJ5_3: U2.97(PE0) ; port MOTOR_EN
NetMD1_3: U2.24(PA2) ; port Timepulse
NetMD1_20: U2.23(PA1) ; port UART4_RX
NetMD1_21: U2.22(PA0) ; port UART4_TX
NetP1_2: U2.92(PB6) ; port UART2_TX
NetP1_3: U2.93(PB7) ; port UART2_RX
NetP2_2: U2.68(PA9) ; port UART1_TX
NetP2_3: U2.69(PA10) ; port UART1_RX
NetR9_1: U2.38(PE8) ; port PWM1
NetR10_1: U2.39(PE9) ; port PWM2
NetR11_1: U2.40(PE10) ; port PWM3
NetR12_1: U2.41(PE11) ; port PWM4
NetR13_1: U2.43(PE13) ; port PWM5
NetR14_1: U2.44(PE14) ; port PWM6
NetR15_1: U2.45(PE15) ; port PWM7
NetR16_1: U2.34(PB0) ; port PWM8
NetR18_1: R18.1 S1.C(NO) S1.D(NO) U2.94(BOOT0)
NetR20_2: R20.2 U4.3(/WP(IO2))
NetR21_2: R21.2 U4.7(/HOLD/RESET(IO3))
NetR27_1: R27.1 U6.5(CS)
NetR42_1: U2.1(PE2) ; port VBAT_MON
NetU1_14: U2.55(PD8) ; port UART3_TX
NetU1_15: U2.56(PD9) ; port UART3_RX
NetU2_98: U2.98(PE1) ; port PWR_GOOD

Not connected (* = marked no-connect by the designer): A1 6(SDO); U2 2(PE3)* 3(PE4)* 4(PE5)* 5(PE6)* 15(PC0)* 16(PC1)* 17(PC2_C)* 18(PC3_C)* 25(PA3)* 32(PC4)* 35(PB1)* 37(PE7)* 42(PE12)* 47(PB11)* 51(PB12)* 52(PB13)* 53(PB14)* 54(PB15)* 57(PD10)* 58(PD11)* 59(PD12)* 60(PD13)* 61(PD14)* 62(PD15)* 64(PC7)* 65(PC8)* 66(PC9) 67(PA8)* 72(PA13)* 76(PA14)* 81(PD0)* 82(PD1)* 83(PD2)* 84(PD3)* 85(PD4)* 86(PD5)* 87(PD6)* 88(PD7)*; U5 8(DRDY)* 9(SD0/SA1); U6 7(RESV)

### Layout directives
differential pair: D_N, D_P

### Notes on the sheet
- Stm32 with all the sensors

### Library data of the parts
A1 = MS561101BA03-50: Sensor;MS5611-BT M-CAPS 3X5X1MM T&R;Pressure;MS561101BA03-50 | TE Connectivity MS561101BA03-50; SnapEDA_Link: https://www.snapeda.com/parts/MS561101BA03-50/TE+Connectivity+ALCOSWITCH+Switches/view-part/?ref=snap; Package: SMD-8 Measurement Specialties; Value: *; MF: TE Connectivity; MP: MS561101BA03-50; Check_prices: https://www.snapeda.com/parts/MS561101BA03-50/TE+Connectivity+ALCOSWITCH+Switches/view-part/?ref=eda
C7 C14 = CMP-1035-00163-2: Part Number: 06031A2R2CAT2A; Manufacturer: AVX Interconnect / Elco
C8-C13 C17 = CMP-14477-003761-2: None; Tolerance: 10%; Voltage Rating: 4V; Capacitance: 1uF; Case/Package: 0201; Packaging: Cut Tape; Case Code (Metric): 0603; RoHS Compliant: Yes; Case Code (Imperial): 0201; Max Operating Temperature: 105°C; Min Operating Temperature: -55°C; Mount: Surface Mount
C15 C16 C19 C20 = CMP-06035-032003-1: as C35 on sheet Power_Management
C18 C21-C27 C33 C34 = CMP-2006-03295-1: Part Number: C0603T104K3RCLTU; Manufacturer: Kemet
C28 C29 = CMP-2006-01139-1: Part Number: VJ0603A180JXAAC; Manufacturer: Vitramon
C30 = CMP-2006-04391-1: Manufacturer: AVX Interconnect / Elco; Part Number: 06035C104KAZ2A
C31 C32 = CMP-03020-029142-1: C0603 12 pF C0G 30ppm/°C 1.00% 100 V; Manufacturer: KEMET; Manufacturer Part Number: C0603C120F1GACAUTO; Material: Ceramic; Automotive Grade: Grade 1; Voltage Rating: 100 V; Tolerance: 0.01; RoHS: TRUE; Temperature Range High: +125°C; ComponentLink2Description: Datasheet; Height: 0.87mm; ComponentLink2URL: https://api.kemet.com/component-edge/download/datasheet/C0603C100J5GACAUTO.pdf; Capacitance: 12 pF; Package: C0603C-CF; Category: Cap; Device Class L1: Passive Components; Temperature: -55°C to +125°C; Value: 12 pF; Device Class L2: Capacitors; Automotive: Yes; Temperature Characteristic: C0G; Device Class L3: Ceramic Capacitors; Lead Free: Yes; Octopart: https://octopart.com/c0603c120f1gacauto-kemet-91893820; Temperature Coefficient: 30ppm/°C; Temperature Range Low: -55°C
R17 = CMP-03412-040683-1: RES 10kΩ 5.00% 0.2W 0603
R18 R19 = CMP-02407-001090-1: RES SMD 100 OHM 1% 1/8W 0603
R20 R21 = CMP-03211-006861-1: CRGP 0805 10K 1%; Manufacturer Part Number: CRGP0805F10K; Manufacturer: TE; Power Rating: 0.33W; Voltage Rating: 150V; Value: 10KΩ; Tolerance: 0.01; Temperature Coefficient: ±100ppm/°C; ComponentLink2URL: https://www.mouser.com/datasheet/2/418/NG_DS_9-1773463-9_A-1358566.pdf; Temperature Range Low: -55°C; Ipc Land Pattern Name: RESC200125X55; Device Class L2: Resistors; Automotive: No; Device Class L3: Chip SMD Resistors; Composition: Thick Film; Temperature Range High: +155°C; Temperature: -55°C to +155°C; Height: 0.65mm; Series: CRGP; RoHS: TRUE; Device Class L1: Passive Components; Octopart: https://octopart.com/crgp0805f10k-te+connectivity-91018782; Package: CRGP0805; Digikey Description: CRGP 0805 10K 1%; Ambient Temperature Range High: +70°C; Lead Free: Yes; ComponentLink2Description: Datasheet; Category: Res; Resistance: 10KΩ
R22-R26 R28 = CMP-2005-00861-1: as R37 on sheet Power_Management
R27 = CMP-26527-001731-1: 100Ω ±1% 0.125W 0805 Thick Film Chip Resistor AEC-Q200 compliant; Power Rating: 250mW; Temperature Coefficient: 100ppm/°C; Resistance: 100R; Max Power Dissipation: 125mW; Radiation Hardening: No; RoHS Compliant: Yes; Case Code (Imperial): 0805; Depth: 1.25mm; Length: 2mm; Min Operating Temperature: -55°C; Series: RMCF; Packaging: Tape and Reel; Features: Automotive AEC-Q200; Height: 0.026inch; Size Code: 0805; Tolerance: 1%; Number of Terminations: 2; Max Operating Temperature: 155°C; Case/Package: 0805; Width: 0.049inch; Contact Plating: Tin; Resistor Type: Thick Film; Construction: Rectangular; Lead Free: Lead Free; Military Standard: Not; Case Code (Metric): 2012; Mount: Surface Mount
S1 = TS-1187A-B-A-B: SPST 50mA @ 12VDC Top Actuated Round Button 160gf SMD Tactile Switches RoHS; MP: TS-1187A-B-A-B; Value: *; Price: None; Package: None; Availability: Unavailable
SW1 = CMP-10040-000033-1: TACT 4.5 X 4.5, 3.8 MM H, 2.5N,; Switch Function: Off-Mom; Switch Travel: 0.25mm; Actuator Type: Standard; Illumination Type: Non-Illuminated; Mechanical Life: 100000Cycles; Ratings: IP40; Operating Force: 250gf; Throw Configuration: SPST; Max Operating Temperature: 70°C; Min Operating Temperature: -20°C; Termination: Gull Wing; Mount: Surface Mount; Packaging: Tape and Reel
U2 = CMP-12105-000050-1: IC MCU 32BIT 2MB FLASH 100LQFP; Manufacturer: STMicroelectronics; Number Of Ethernet Channels: 1; Number Of Usb Channels: 2; Number Of A/D Converters: 3; Min Supply Voltage: 1.71V; Ram Size: 1060KBytes; Number Of I2C Channels: 4; Frequency: 480MHz; Number Of Adc Channels: 36; Number Of I/Os: 82; Max Supply Voltage: 3.6V; Number Of Spi Channels: 6; Memory Size: 2MBytes; Max Junction Temp: +125°C; Core Architecture: Arm Cortex-M7; Interface: I2C,SPI,UART,USART,USB,LIN,IrDA,Ethernet,I2S,Other; Number Of Timers/Counters: 20; Data Bus Width: 32bits; Number Of Pwm Channels: 42; Number Of Uart Channels: 9; Standoff Height: 0.05mm; Device Class L1: Integrated Circuits (ICs); ComponentLink2URL: https://www.st.com/resource/en/datasheet/stm32h743vi.pdf; Automotive: No; Memory Type: FLASH; Number Of Cores: 1; Temperature Range Low: -40°C; RoHS: TRUE; Ambient Temperature Range Low: -40°C; ComponentLink2Description: Datasheet; Device Class L2: Embedded Processors and Controllers; Device Class L3: Microcontrollers; Digikey Description: IC MCU 32BIT 2MB FLASH 100LQFP; Temperature Range High: +125°C; Ambient Temperature Range High: +85°C; Package: LQFP100-1L; Temperature: -40°C to +125°C; Category: IC; Ipc Land Pattern Name: QFP50P1600X1600X160-100; Height: 1.6mm; Manufacturer Part Number: STM32H743VIT6; Octopart: https://octopart.com/stm32h743vit6-stmicroelectronics-76372527; Lead Free: Yes
U3 = ICM-42688-P: Accelerometer, Gyroscope, 6 Axis Sensor Output; Package: None; MP: ICM-42688-P; Value: *; Availability: Unavailable; Price: None
U4 = W25Q128JVSIQ: FLASH - NOR Memory IC 128Mb (16M x 8) SPI - Quad I/O, QPI, DTR 133 MHz 8-SOIC; MF: Winbond Electronics; SnapEDA_Link: https://www.snapeda.com/parts/W25Q128JVSIQ/Winbond/view-part/?ref=snap; Package: SOIC-8 Winbond Electronics; Value: *; MP: W25Q128JVSIQ; Check_prices: https://www.snapeda.com/parts/W25Q128JVSIQ/Winbond/view-part/?ref=eda
U5 = CMP-2000-07463-2: SENSOR MR I2C/SPI 12LGA; Manufacturer: STMicroelectronics; Sensor Output: I2C,SPI; Operating Supply Current: 40-270uA; Max Supply Voltage: 3.6V; Sensing Method: Magnetic; Min Supply Voltage: 1.71V; ComponentLink2URL: https://www.st.com/resource/en/datasheet/lis3mdl.pdf; Category: IC; Manufacturer Part Number: LIS3MDLTR; Octopart: https://octopart.com/lis3mdltr-stmicroelectronics-29403125; Automotive: No; ComponentLink2Description: Datasheet; RoHS: TRUE; Device Class L3: unset; Device Class L1: Sensors; Temperature: -40°C to +85°C; Height: 1mm; Mouser Description: Board Mount Hall Effect / Magnetic Sensors Ultra Lo-Pwr Hi Perf 3-Axis 1.9-3.6V; Temperature Range High: +85°C; Lead Free: Yes; Device Class L2: Magnetic Sensors; Footprint Url: https://www.st.com/content/ccc/resource/technical/document/technical_note/73/17/9c/16/dd/96/4a/01/CD00134799.pdf/files/CD00134799.pdf/jcr:content/translations/en.CD00134799.pdf; Temperature Range Low: -40°C; Package: VFLGA-12-8365767; Digikey Description: SENSOR MR I2C/SPI 12LGA
U6 = CMP-2000-07589-1: High Performance 6-Axis MEMS MotionTracking(TM) Device, 1.71 to 3.45 V, -40 to 85 degC, 16-Pin LGA, RoHS; Manufacturer: InvenSense; Sensor Type: Temperature; Output Type: I2C; RoHSCompliant: True; Datasheet Version: Rev. 1.0, 10/2016; Datasheet URL: http://www.invensense.com/wp-content/uploads/2016/10/DS-000176-ICM-20602-v1.0.pdf; Min Operating Temperature: -40degC; Mounting Technology: SurfaceMount; Max Operating Temperature: 85degC; Manufacturer URL: http://www.invensense.com/; Package Reference: I62-16; Package Description: 16-Pin Land Grid Array, Body 3 x 3 mm, Pitch 0.5 mm
Y1 = SXT32412BB07-25.000MT: 25 MHz Â±30ppm Crystal 12pF 50 Ohms 4-SMD, No Lead; MF: Suntsu; SnapEDA_Link: https://www.snapeda.com/parts/SXT32412BB07-25.000M/Suntsu/view-part/?ref=snap; Package: NON STANDARD-4 Suntsu; Value: *; MP: SXT32412BB07-25.000M; Check_prices: https://www.snapeda.com/parts/SXT32412BB07-25.000M/Suntsu/view-part/?ref=eda
Y2 = CMP-0447-00001-4: Crystal 32.768kHz ±20ppm (Tol) 12.5pF FUND 70kΩ 2-Pin CSMD T/R; ESR (Equivalent Series Resistance): 70kR; Radiation Hardening: No; Frequency: 32.768kHz; Length: 3.2mm; Max Operating Temperature: 85°C; Number of Pins: 2; Series: ABS07; Min Operating Temperature: -40°C; Frequency Tolerance: 20ppm; Packaging: Tape and Reel; Height: 0.9mm; Width: 1.5mm; Depth: 1.5mm; Load Capacitance: 12.5pF; RoHS Compliant: Yes; Tolerance: 20ppm; Termination: SMD/SMT; Lead Free: Lead Free; Series Resistance: 70kR; REACH SVHC: No SVHC; Case/Package: CSMD; Operating Frequency: 32.768 kHz; Package Quantity: 3000

## Sheet Communication.SchDoc
size A4; SheetNumber: 4; SheetTotal: 5
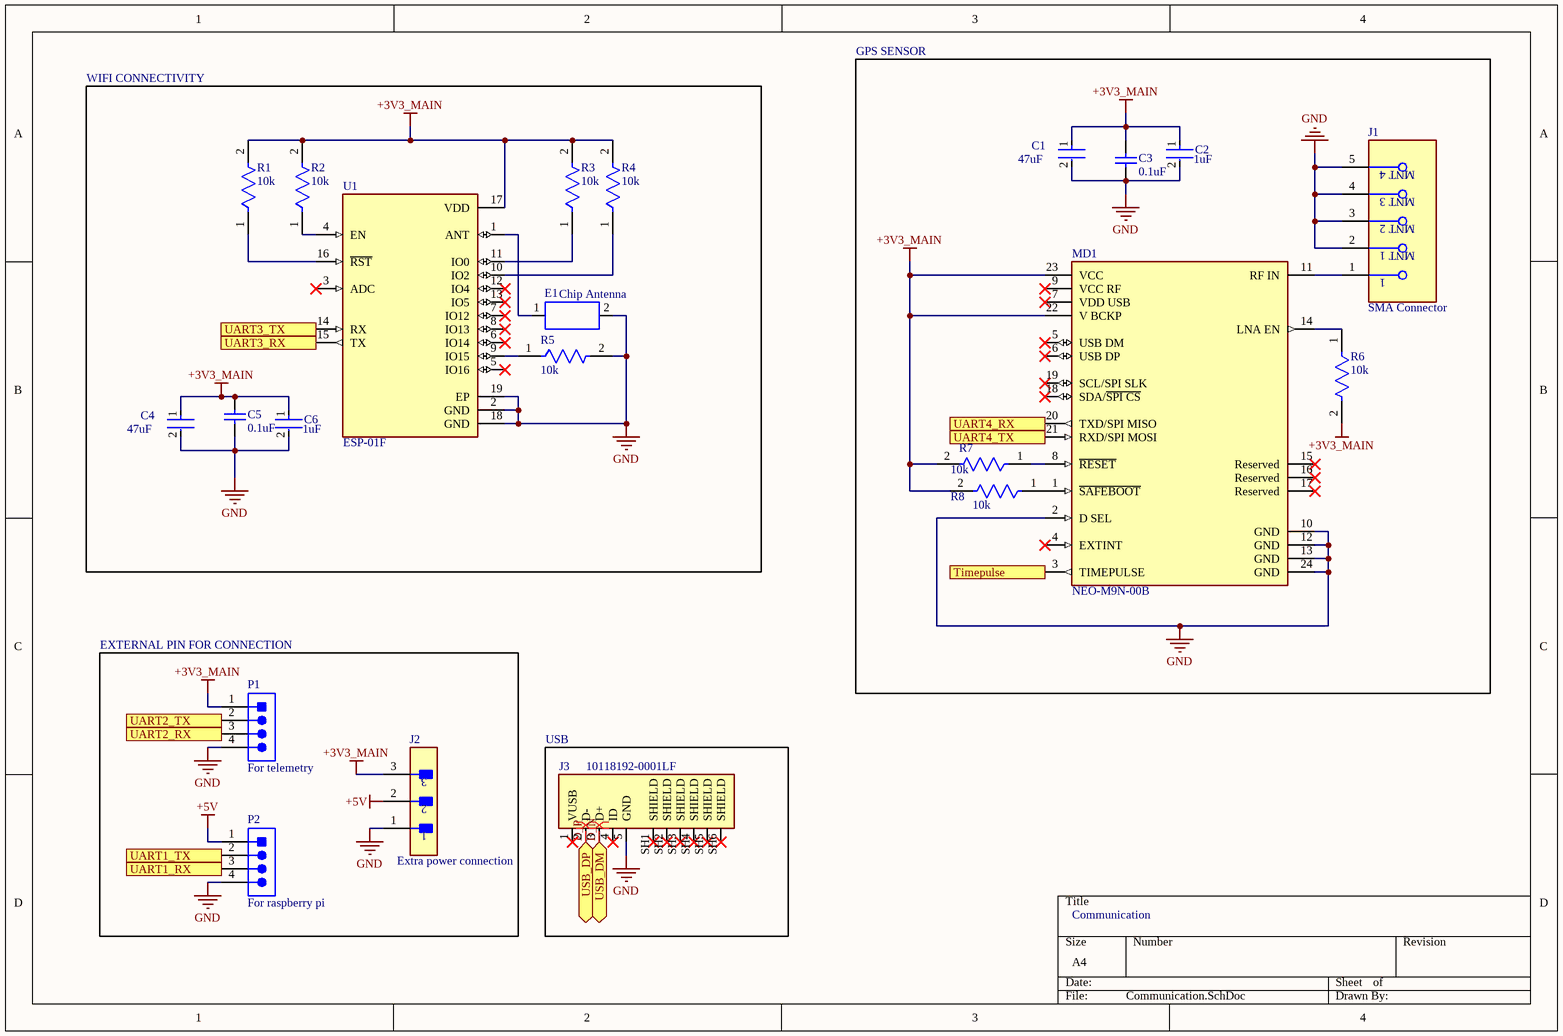
[diagram p3: Communication.SchDoc]

### Parts
C1  47uF  [FP-0603-L_1_6_0_2-W_0_8_0-MFG]
C2  1uF  [FP-GCJ21B-0_3-IPC_B]
C3  0.1uF  [CAPC1608X87X35ML15T15]
C4  47uF  [FP-0603-L_1_6_0_2-W_0_8_0-MFG]
C5  0.1uF  [CAPC1608X87X35ML15T15]
C6  1uF  [FP-GCJ21B-0_3-IPC_B]
E1  Chip Antenna  [TAYO-AH316M-2_M]
J1  SMA Connector  [FP-CON-SMA-EDGE-S-MFG]
J2  Extra power connection  [FP-B3B-XH-AM_LF_SN-MFG]
J3  10118192-0001LF  [AMPHENOL_10118192-0001LF]
MD1  NEO-M9N-00B  [FP-NEO-M9N-00B-MFG]
P1  For telemetry  [JST-B4B-EH-A_V]
P2  For raspberry pi  [JST-B4B-EH-A_V]
R1  10k  [FP-CRGP0805-IPC_C]
R2  10k  [FP-CRGP0805-IPC_C]
R3  10k  [FP-CRGP0805-IPC_C]
R4  10k  [FP-CRGP0805-IPC_C]
R5  10k  [FP-CRGP0805-IPC_C]
R6  10k  [FP-CRGP0805-IPC_C]
R7  10k  [FP-CRGP0805-IPC_C]
R8  10k  [FP-CRGP0805-IPC_C]
U1  ESP-01F  [MODULE_ESP-01F]

### Blocks framed on the sheet
WIFI CONNECTIVITY: C4-C6 E1 R1-R5 U1
GPS SENSOR: C1-C3 J1 MD1 R6-R8
EXTERNAL PIN FOR CONNECTION: J2 P1 P2
USB: J3

### Ports
Timepulse (out, see EMP_FC_Main[3B], MCU_Core[4B]), UART1_RX (out, see EMP_FC_Main[3B], MCU_Core[4B]), UART1_TX (in, see EMP_FC_Main[3B], MCU_Core[4B]), UART2_RX (out, see EMP_FC_Main[3B], MCU_Core[5B]), UART2_TX (in, see EMP_FC_Main[3B], MCU_Core[5B]), UART3_RX (out, see EMP_FC_Main[3B], MCU_Core[1B]), UART3_TX (in, see EMP_FC_Main[3B], MCU_Core[1B]), UART4_RX (out, see EMP_FC_Main[3B], MCU_Core[4B]), UART4_TX (in, see EMP_FC_Main[3B], MCU_Core[4B]), USB_DM (bidir, see EMP_FC_Main[3B], MCU_Core[4B]), USB_DP (bidir, see EMP_FC_Main[3B], MCU_Core[4B])

### Nets
+3V3_MAIN: C1.1 C2.1 C3.2 C4.1 C5.2 C6.1 J2.3 MD1.22(V_BCKP) MD1.23(VCC) P1.1 R1.2 R2.2 R3.2 R4.2 R6.2 R7.2 R8.2 U1.17(VDD)
+5V: J2.2 P2.1
GND: C1.2 C2.2 C3.1 C4.2 C5.1 C6.2 E1.2 J1.2(MNT_1) J1.3(MNT_2) J1.4(MNT_3) J1.5(MNT_4) J2.1 J3.5(GND) MD1.2(D_SEL) MD1.10(GND) MD1.12(GND) MD1.13(GND) MD1.24(GND) P1.4 P2.4 R5.2 U1.2(GND) U1.18(GND) U1.19(EP)
D_N: J3.3(D+) ; port USB_DM
D_P: J3.2(D-) ; port USB_DP
NetE1_1: E1.1 U1.1(ANT)
NetJ1_1: J1.1 MD1.11(RF_IN)
NetMD1_1: MD1.1(~{SAFEBOOT}) R8.1
NetMD1_3: MD1.3(TIMEPULSE) ; port Timepulse
NetMD1_8: MD1.8(~{RESET}) R7.1
NetMD1_14: MD1.14(LNA_EN) R6.1
NetMD1_20: MD1.20(TXD/SPI_MISO) ; port UART4_RX
NetMD1_21: MD1.21(RXD/SPI_MOSI) ; port UART4_TX
NetP1_2: P1.2 ; port UART2_TX
NetP1_3: P1.3 ; port UART2_RX
NetP2_2: P2.2 ; port UART1_TX
NetP2_3: P2.3 ; port UART1_RX
NetR1_1: R1.1 U1.16(~{RST})
NetR2_1: R2.1 U1.4(EN)
NetR3_1: R3.1 U1.11(IO0)
NetR4_1: R4.1 U1.10(IO2)
NetR5_1: R5.1 U1.9(IO15)
NetU1_14: U1.14(RX) ; port UART3_TX
NetU1_15: U1.15(TX) ; port UART3_RX

Not connected (* = marked no-connect by the designer): J3 1(VUSB)* 4(ID)* SH1(SHIELD)* SH2(SHIELD)* SH3(SHIELD)* SH4(SHIELD)* SH5(SHIELD)* SH6(SHIELD)*; MD1 4(EXTINT)* 5(USB_DM)* 6(USB_DP)* 7(VDD_USB)* 9(VCC_RF)* 15(Reserved)* 16(Reserved)* 17(Reserved)* 18(SDA/~{SPI_CS})* 19(SCL/SPI_SLK)*; U1 3(ADC)* 5(IO16)* 6(IO14)* 7(IO12)* 8(IO13)* 12(IO4)* 13(IO5)*

### Layout directives
differential pair: D_N, D_P

### Notes on the sheet
- Communication

### Library data of the parts
C1 C4 = CMP-14477-005318-1: as C41 on sheet Power_Management
C2 C6 = CMP-06035-032003-1: as C35 on sheet Power_Management
C3 C5 = CMP-2006-03295-1: as C18 on sheet MCU_Core
E1 = CMP-00025-00001-2: Chip Antenna, 2.4 to 2.5 GHz, -40 to 85 degC, 2-Pin SMD, Pb-Free, Tape and Reel; Manufacturer: Taiyo Yuden; Frequency: 2.45GHz; Impedance: 50Ohm; Manufacturer URL: http://www.t-yuden.com/; Datasheet Version: Sep-15; Min Operating Temperature: -20°C; Mounting Technology: SM; RoHS Compliant: True; Case/Package: AH316M-2; Datasheet URL: http://www.yuden.co.jp/productdata/catalog/en/chipantenna01_e.pdf; Max Operating Temperature: 80°C; Package Quantity: 3000; Pins: 2; Packaging: TapeandReel; Package Description: 2-Pin Surface Mount Device, Body 3.2 x 1.6 mm; Package Reference: AH316M-2
J1 = CMP-204357-000001-1: CONN SMA JACK STR EDGE MNT; Manufacturer Part Number: CON-SMA-EDGE-S; Manufacturer: RF Solutions Ltd.; Impedance: 50Ω; Conn Orientation: Right Angle; Is Female: yes; Number Of Contacts: 1; Frequency: 18GHz; Shielding: true; Category: Conn; ComponentLink2URL: https://www.rfsolutions.co.uk/downloads/1498648656DS-CON-EDGE-SMA-4.pdf; Octopart: https://octopart.com/con-sma-edge-s-rf+solutions-70967450; Package: CONN_JACK; Height: 6.35mm; Device Class L1: Connectors; Footprint Url: https://forum.upverter.com/uploads/default/original/3X/b/e/be75b907af57498775929d6d9099689c472e0307.pdf; Contact Material: Gold; ComponentLink2Description: Datasheet; Device Class L2: RF / Coaxial Connectors; RoHS: TRUE; Device Class L3: unset; Digikey Description: CONN SMA JACK STR EDGE MNT; Lead Free: Yes; Automotive: No
J2 = CMP-17438-000009-1: CONN HEADER VERT 3POS 2.5MM; Max Current Rating: 3A; Gender: Male; Max Voltage Rating (AC): 250V; Connector Type: Male Pin; Pitch: 0.098inch; Number of Positions: 3; Contact Resistance: 20mR; Termination: Press-Fit; Housing Color: White; Housing Material: Polyamide; Orientation: Straight; Contact Material: Brass; Contact Type: Male Pin; Color: Natural; Packaging: Bulk; Lead Free: Lead Free; Depth: 5.75mm; Number of Rows: 1; Contact Plating: Tin; Length: 9.9mm; Max Operating Temperature: 85°C; Series: XH; Min Operating Temperature: -25°C; Fastening Type: Detent; Mount: Through Hole
J3 = 10118192-0001LF: Micro USB, Input Output Connectors, B TYPE RECEPTACLE with flange; MF: Amphenol ICC; Check_prices: https://www.snapeda.com/parts/10118192-0001LF/Amphenol+FCI/view-part/?ref=eda; Value: *; Availability: In Stock; MP: 10118192-0001LF; Price: None; Package: None; Purchase-URL: https://pricing.snapeda.com/search/part/10118192-0001LF/?ref=eda; SnapEDA_Link: https://www.snapeda.com/parts/10118192-0001LF/Amphenol+FCI/view-part/?ref=snap
MD1 = CMP-207130-000006-2: M9 standard precision module; Manufacturer: u-blox; Min Supply Voltage: 1.65V; Sensitivity: -167dBm; Interface: I2C,SPI,UART,USB; Max Supply Voltage: 3.6V; Device Class L3: RF Receivers; Category: UNK; Temperature Range Low: -40°C; Temperature Range High: +85°C; ComponentLink2Description: Datasheet; Manufacturer Part Number: NEO-M9N-00B; ComponentLink2URL: https://www.u-blox.com/sites/default/files/NEO-M9N_DataSheet_%28UBX-19014285%29.pdf; Footprint Url: https://www.u-blox.com/sites/default/files/NEO-M9N_Integrationmanual_%28UBX-19014286%29.pdf; Height: 2.6mm; Automotive: No; RoHS: TRUE; Lead Free: Yes; Octopart: https://octopart.com/neo-m9n-00b-u-blox-107315722; Package: 0; Temperature: -40°C to +85°C; Device Class L1: Integrated Circuits (ICs); Device Class L2: RF Semiconductors and Devices
P1 P2 = CMP-2000-05904-1: Male Header, Pitch 2.5 mm, 1 x 4 Position, Height 6 mm, Tail Length 3.2 mm, -25 to 85 degC, RoHS, Bulk; Manufacturer: JST; Style/Orientation: StraightHeader/Plug; Pitch: 2.5mm; No of Positions: 4; Mounting Technology: SurfaceMount; Package Description: Male Header, Pitch 2.5 mm, 1 x 4 Position, Height 6 mm, Tail Length 3.2 mm; Datasheet Version: 12/2012; Type: ShroudedHeader; Package Reference: B4B-EH-A; Manufacturer URL: http://www.jst.com/home2.html; Termination: Crimp; Datasheet URL: http://www.jst-mfg.com/product/pdf/eng/eEH.pdf
R1-R8 = CMP-03211-006861-1: as R20 on sheet MCU_Core; ComponentLink2URL: https://www.mouser.com/datasheet/2/418/NG_DS_9-1773463-9_A-1358566.pdf; Temperature Range Low: -55°C; Ipc Land Pattern Name: RESC200125X55; Device Class L2: Resistors; Automotive: No; Device Class L3: Chip SMD Resistors; Composition: Thick Film; Temperature Range High: +155°C; Temperature: -55°C to +155°C; Height: 0.65mm; Series: CRGP; RoHS: TRUE; Device Class L1: Passive Components; Octopart: https://octopart.com/crgp0805f10k-te+connectivity-91018782; Package: CRGP0805; Digikey Description: CRGP 0805 10K 1%; Ambient Temperature Range High: +70°C; Lead Free: Yes; ComponentLink2Description: Datasheet; Category: Res; Resistance: 10KΩ
U1 = ESP-01F: 802.11b/g/n Wi-Fi SOC module; MF: AI-Thinker; SnapEDA_Link: https://www.snapeda.com/parts/ESP-01F/AI-Thinker/view-part/?ref=snap; Package: None; Value: *; MP: ESP-01F; Check_prices: https://www.snapeda.com/parts/ESP-01F/AI-Thinker/view-part/?ref=eda